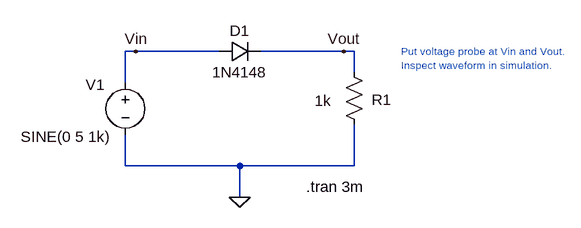
[diagram p0: schematic 03-half-wave-rectify-transient-sim.asc]
03-half-wave-rectify-transient-sim.asc, the LTspice schematic file:
Version 4
SHEET 1 880 680
WIRE -32 112 -48 112
WIRE 96 112 -32 112
WIRE 288 112 160 112
WIRE 304 112 288 112
WIRE 304 144 304 112
WIRE -48 160 -48 112
WIRE -48 288 -48 240
WIRE 128 288 -48 288
WIRE 304 288 304 224
WIRE 304 288 128 288
WIRE 128 336 128 288
FLAG 128 336 0
FLAG -32 112 Vin
FLAG 288 112 Vout
SYMBOL diode 96 128 R270
WINDOW 0 32 32 VTop 2
WINDOW 3 0 32 VBottom 2
SYMATTR InstName D1
SYMATTR Value 1N4148
SYMBOL res 288 128 R0
WINDOW 0 43 58 Left 2
WINDOW 3 -45 60 Left 2
SYMATTR InstName R1
SYMATTR Value 1k
SYMBOL voltage -48 144 R0
WINDOW 0 -61 19 Left 2
WINDOW 3 -161 99 Left 2
WINDOW 123 0 0 Left 0
WINDOW 39 0 0 Left 0
SYMATTR InstName V1
SYMATTR Value SINE(0 5 1k)
TEXT 230 320 Left 2 !.tran 3m
TEXT 376 112 Left 1 ;Put voltage probe at Vin and Vout.\nInspect waveform in simulation.

The netlist it stands for:
* 03-half-wave-rectify-transient-sim.asc
D1 Vin Vout 1N4148
R1 Vout 0 1k
V1 Vin 0 SINE(0 5 1k)
.model D D
.lib standard.dio
.tran 3m
* Put voltage probe at Vin and Vout.
* Inspect waveform in simulation.
.backanno
.end